# EAGLE design MRCS-QandD-Carbon-Mic-Adapter (EAGLE 7.7.0)
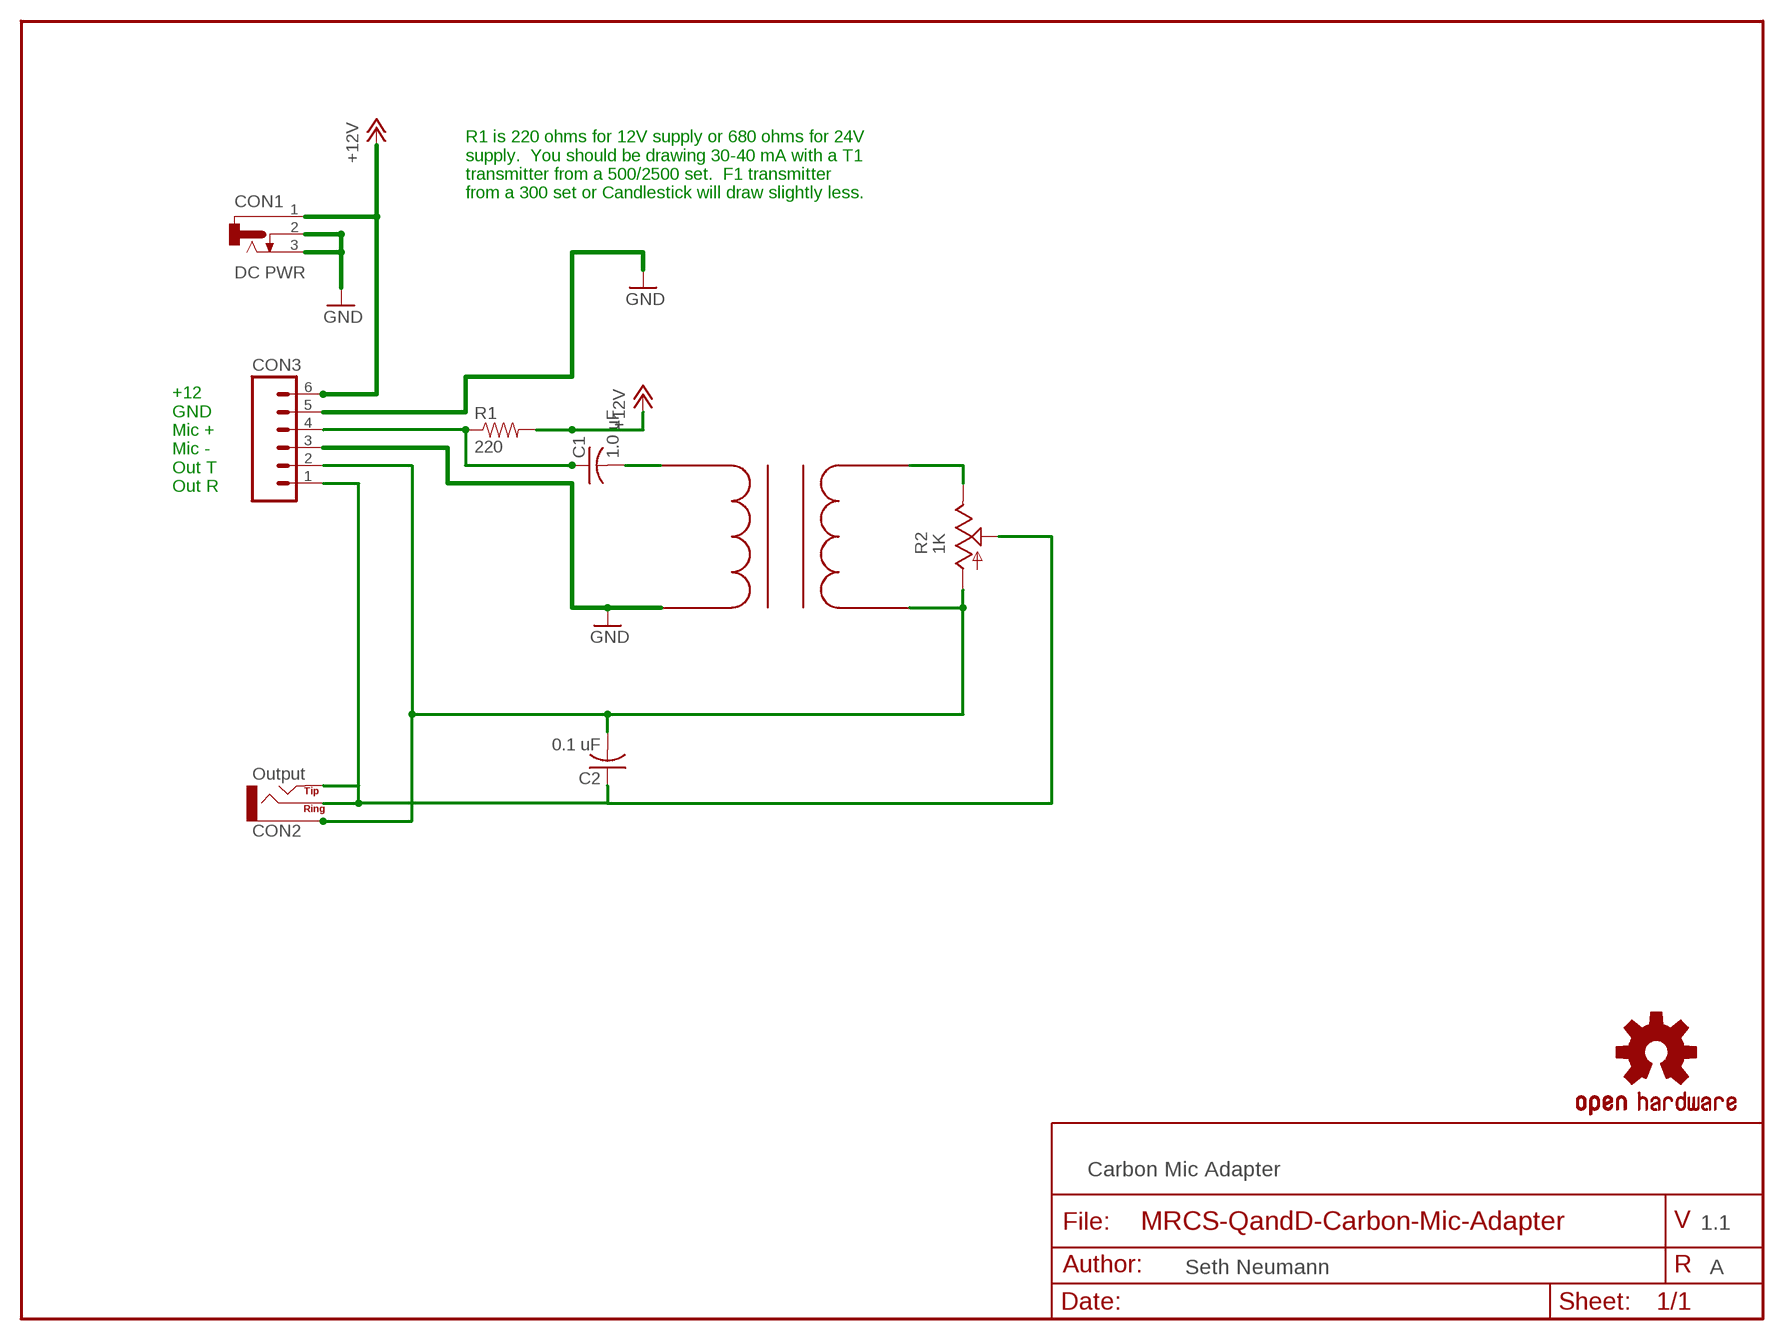
[diagram p0: schematic, sheet 1]

## Parts
C1  1.0 uF  CAPPTH2  [C-PTH-0.100]
C2  0.1 uF  CAPPTH2  [C-PTH-0.100]
CON1  DC PWR  CONNECTOR-DC-POWER-RA  [DCJ0202]
CON2  Output  CONNECTOR-AUDIO3.5MM-ADAMTECH  [AUDIO-JACK-3.5MM_STEREO]
CON3  CONNECTOR-M063.5MM-6  [SCREWTERMINAL-3.5MM-6]
OSHW1  DOC-OSHW-LOGO-M  [OSHW-LOGO-M]
R1  220  RPTH04  [AXIAL-0.4-RES]
R2  1K  TRIM_US-RS3  [RS3]
U$1  EI14_600-600  [XFMR580X500]

## Nets
+12V: CON1.1 CON3.6 R1.P$2
GND: CON1.2 CON1.3 CON3.3 CON3.5 U$1.PBOTTOM
MIC+: C1.1 CON3.4 R1.P$1
N$1: R2.E U$1.STOP
N$3: C1.2 U$1.PTOP
N$7: C2.1 CON2.RING CON2.TIP CON3.1 R2.S
OUTT: C2.2 CON2.GND(SLEEVE) CON3.2 R2.A U$1.SBOTTOM

## Notes on the sheet
- R1 is 220 ohms for 12V supply or 680 ohms for 24V
  supply.  You should be drawing 30-40 mA with a T1
  transmitter from a 500/2500 set.  F1 transmitter
  from a 300 set or Candlestick will draw slightly less.
- +12
  GND
  Mic +
  Mic -
  Out T
  Out R
- Carbon Mic Adapter
- 1.1
- Seth Neumann | A

## Library data of the parts
C1 C2 = SPCoast:CAP*
CON1 = SPCoast:CONNECTOR-DC-POWER: DC POWER JACK
CON2 = SPCoast:CONNECTOR-AUDIO: 3.5mm Audio Jack PCB mount SKU: PRT-08032
CON3 = SPCoast:CONNECTOR-M06: Header 6 Standard 6-pin 0.1" header
OSHW1 = SPCoast:DOC-OSHW-LOGO-: Open Source Hardware Logo This logo indicates the piece of hardware it is found on incorporates a OSHW license and/or adheres to the definition of open source hardware http://freedomdefined.org/OSHW Creative Commons - Attribution - ShareAlike 3.0
R1 = SPCoast:R*: Resistor Basic schematic elements and footprints for 0603, 1206, and PTH 1/10th watt (small) resistors.
R2 = pot:TRIM_US-: POTENTIOMETER
U$1 = MRCS:EI14_600-600: EI14 600-600 ohm coupling xfmr - non saturating

## Board
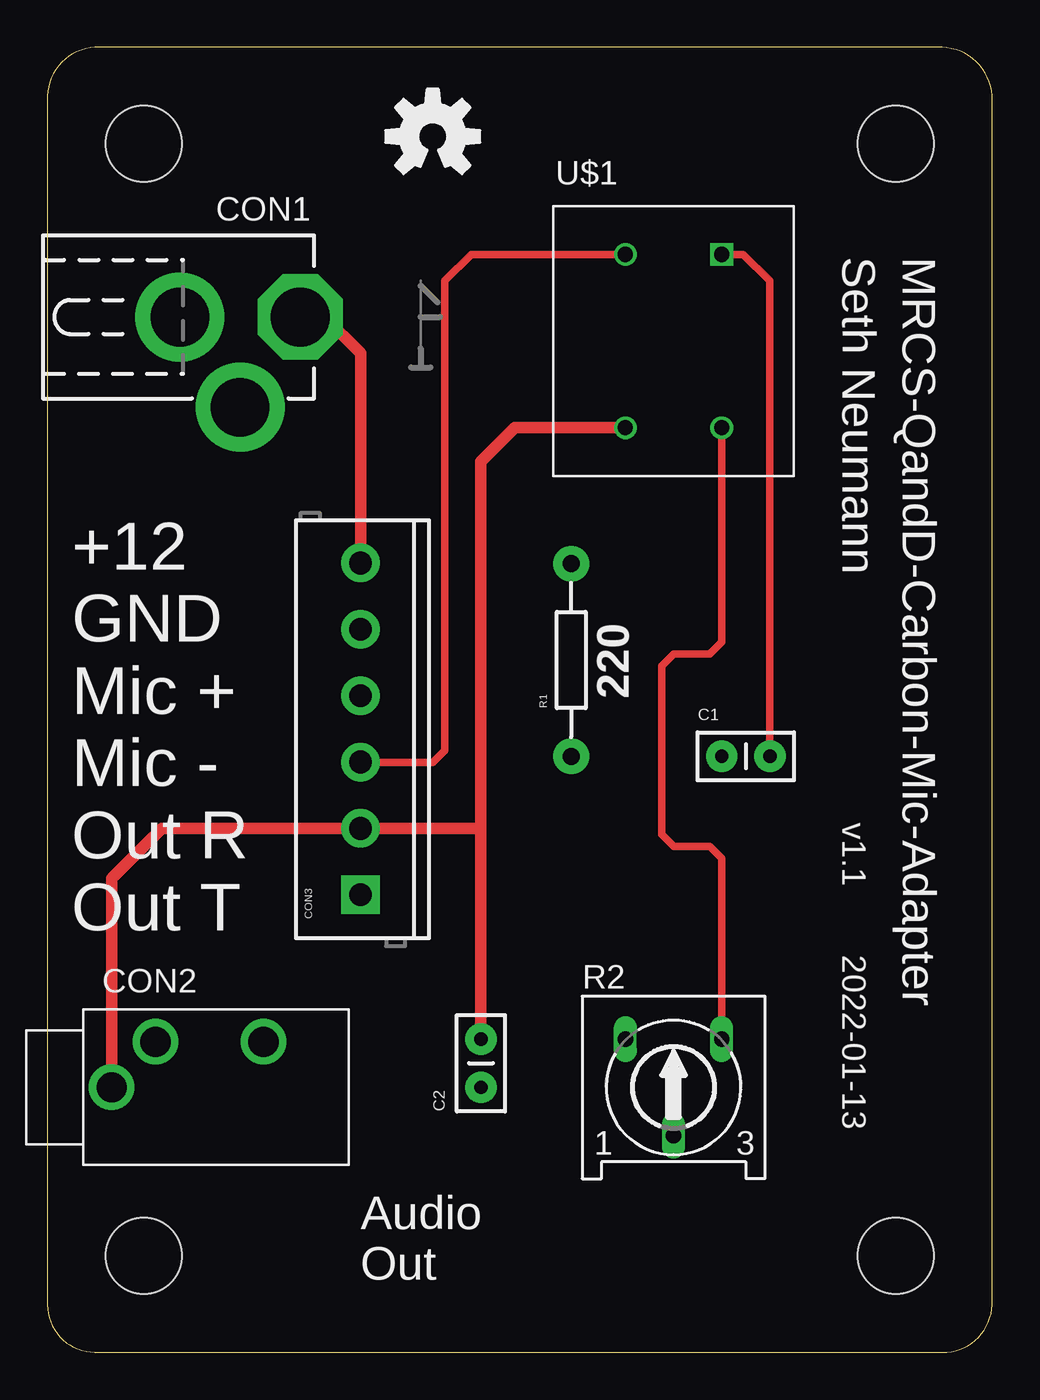
[diagram p1: board, top side]
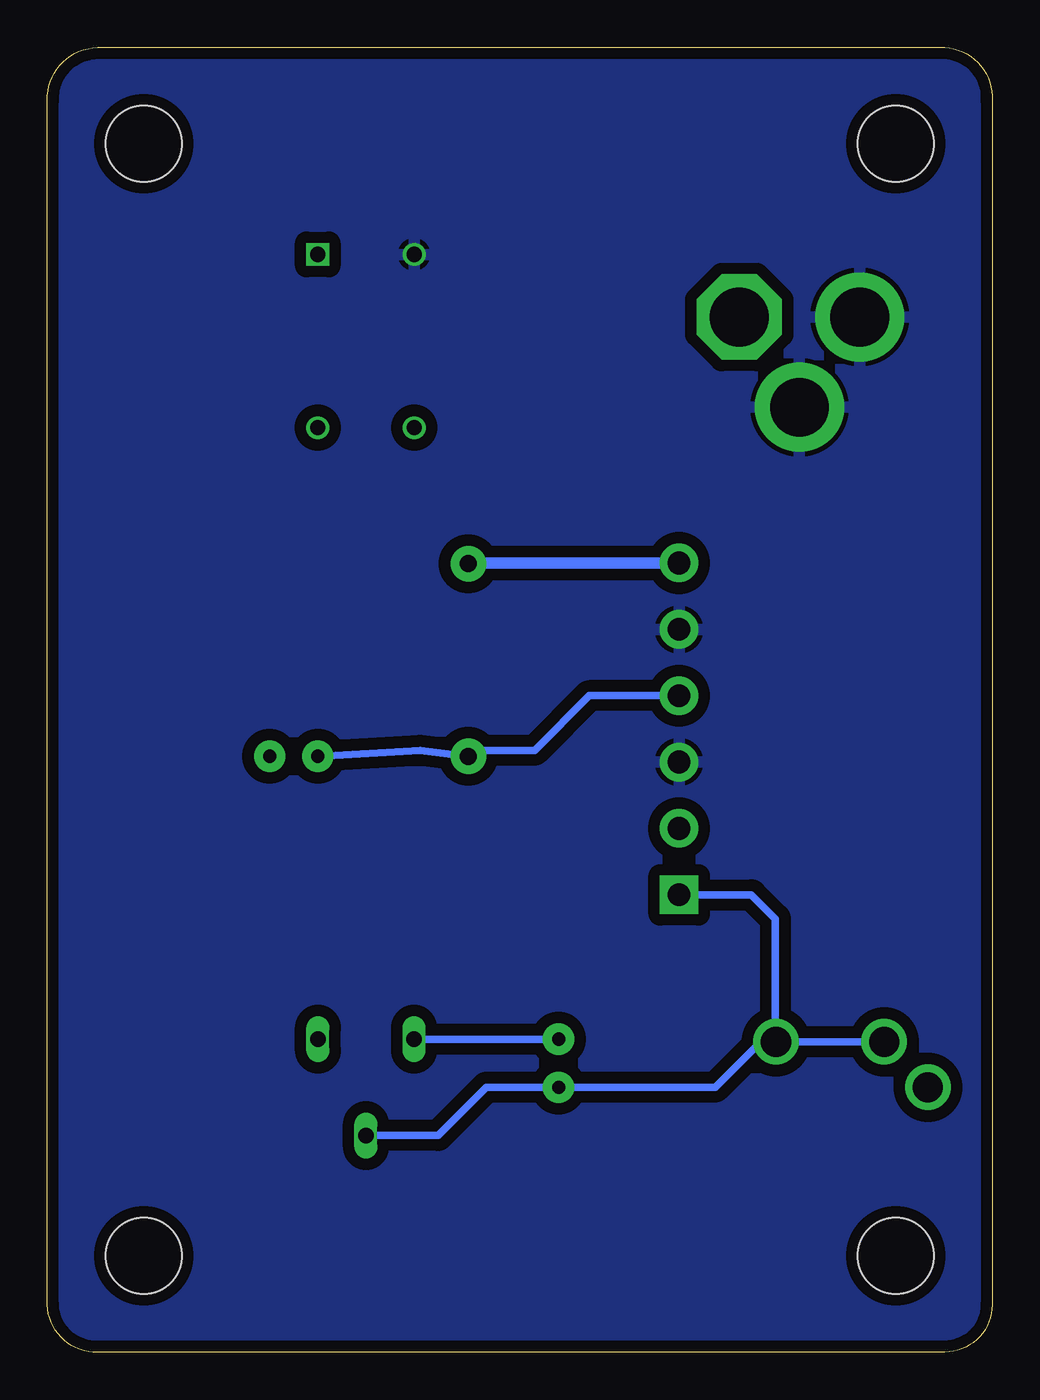
[diagram p2: board, bottom side, seen from below]

Size 49.82 x 68.83 mm. Coordinates in mm from the lower left corner, seen from the top.
Copper layers (1*16): Top 0.035mm / dielectric 1.5mm / Bottom 0.035mm
Design rules "default *": minimum track width 5mil, minimum drill 0.2mm, track to track 5mil, track to pad 5mil, pad to pad 5mil, via to via 5mil, smd to smd 5mil, copper to edge 0.4mm, drill to drill 5mil, minimum pad ring 3mil, minimum via ring 3mil, stop-mask expansion 4mil, vias tented up to drill 0mil, thermal gap 10mil

### Footprints (pad centres in the part's own frame; a part is rotated, then mirrored left to right if it is on the bottom)
C-PTH-0.100 = drill 0.7 pad 1.651: 1 -1.27,0; 2 1.27,0
DCJ0202 = drill 3.1 pad 4.5 octagon: 1 0,3.175 | drill 3.1 pad 4.7: 2 4.763,0; 3 0,-3.175
AUDIO-JACK-3.5MM_STEREO = drill 1.6: GND -5.5,0; RING 2.5,2.4; TIP -3.2,2.4
SCREWTERMINAL-3.5MM-6 = drill 1.2 pad 2.032 square: 1 0,0 | drill 1.2 pad 2.032: 2 3.5,0; 3 7,0; 4 10.5,0; 5 14,0; 6 17.5,0
AXIAL-0.4-RES = drill 0.9 pad 1.88: P$1 -5.08,0; P$2 5.08,0
RS3 = drill 0.813 long: A -2.54,2.54; E 2.54,2.54; S 0,-2.54
XFMR580X500 = drill 0.8: PBOTTOM -2.54,4.572; SBOTTOM -2.54,-4.572; STOP 2.54,-4.572 | drill 0.8 square: PTOP 2.54,4.572
BOARD-DINRAIL-2.7IN-5CM = hole 4: 44.742,5.08; 5.08,63.754; 44.742,63.754; 5.08,5.08

### Placement (x,y rotation side)
C1  36.83,31.43 0 top
C2  22.86,15.24 90 top
CON1  10.16,54.61 270 top
CON2  8.89,13.97 0 top
CON3  16.51,24.13 90 top
OSHW1  20.32,64.14 0 top
R1  27.62,36.51 90 top
R2  33.02,13.97 0 top
U$1  33.02,53.34 0 top
U$2  [BOARD-DINRAIL-2.7IN-5CM]  0,0 0 top
U$3  [MRCSLOGOTOP]  18.42,51.44 0 top
U$4  [CA-PROP65WARNING]  31.12,23.5 0 top

### Tracks (layer width: path | path; a pad name or v marks a point on that pad's centre or on a via)
+12V
  Top 0.61: CON1.1 14.61,54.61 16.51,52.7 CON3.6
  Bottom 0.61: CON3.6 27.66,41.63 R1.P$2
GND
  Top 0.406: U$1.PBOTTOM 22.35,57.91 20.96,56.52 20.96,31.75 20.32,31.11 16.53,31.11 CON3.3
  pour Bottom (isolate 0.61): 0,0 49.53,0 50.17,0.64 50.17,68.58 0,68.58
MIC+
  Bottom 0.406: CON3.4 21.25,34.63 24.13,31.75 27.31,31.75 R1.P$1 30.17,31.75 C1.1
N$1
  Top 0.406: U$1.STOP 35.56,37.47 34.93,36.83 33.02,36.83 32.39,36.2 32.39,27.3 33.02,26.67 34.93,26.67 35.56,26.04 R2.E
N$3
  Top 0.406: U$1.PTOP 36.71,57.91 38.1,56.52 C1.2
N$7
  Bottom 0.406: R2.S 29.21,11.43 26.67,13.97 C2.1 14.61,13.97 12.21,16.37 CON2.RING | CON2.TIP CON2.RING | CON3.1 12.7,24.13 11.43,22.86 11.43,16.41 CON2.RING
OUTT
  Top 0.406: CON3.2 | 22.54,27.63 22.86,27.3
  Top 0.61: U$1.SBOTTOM 24.64,48.77 22.86,46.99 22.86,27.3 C2.2 | CON3.2 6.03,27.62 3.81,25.4 3.39,24.98 CON2.GND | CON3.2 22.54,27.63
  Bottom 0.406: C2.2 R2.A

### Text on the board
tPlace: Seth Neumann | v1.1 | +12 / GND / Mic + / Mic - / Out R / Out T | 2022-01-13 | Audio / Out
Document: Use tPlace/bPlace for silkscreen text and drawings / Use Document, tDocu and bDocu for assembly notes and documentation that does NOT go on the board